# Altium schematic sheet Microcontroller.SchDoc
size A; Organization: Underwater Robotics; Address1: c/o Student Involvement; Address2: Campus Box 7306; Address3: 2016 Cates Ave. Raleigh, NC 27695; Revision: A1; SheetNumber: 2B; SheetTotal: 4B
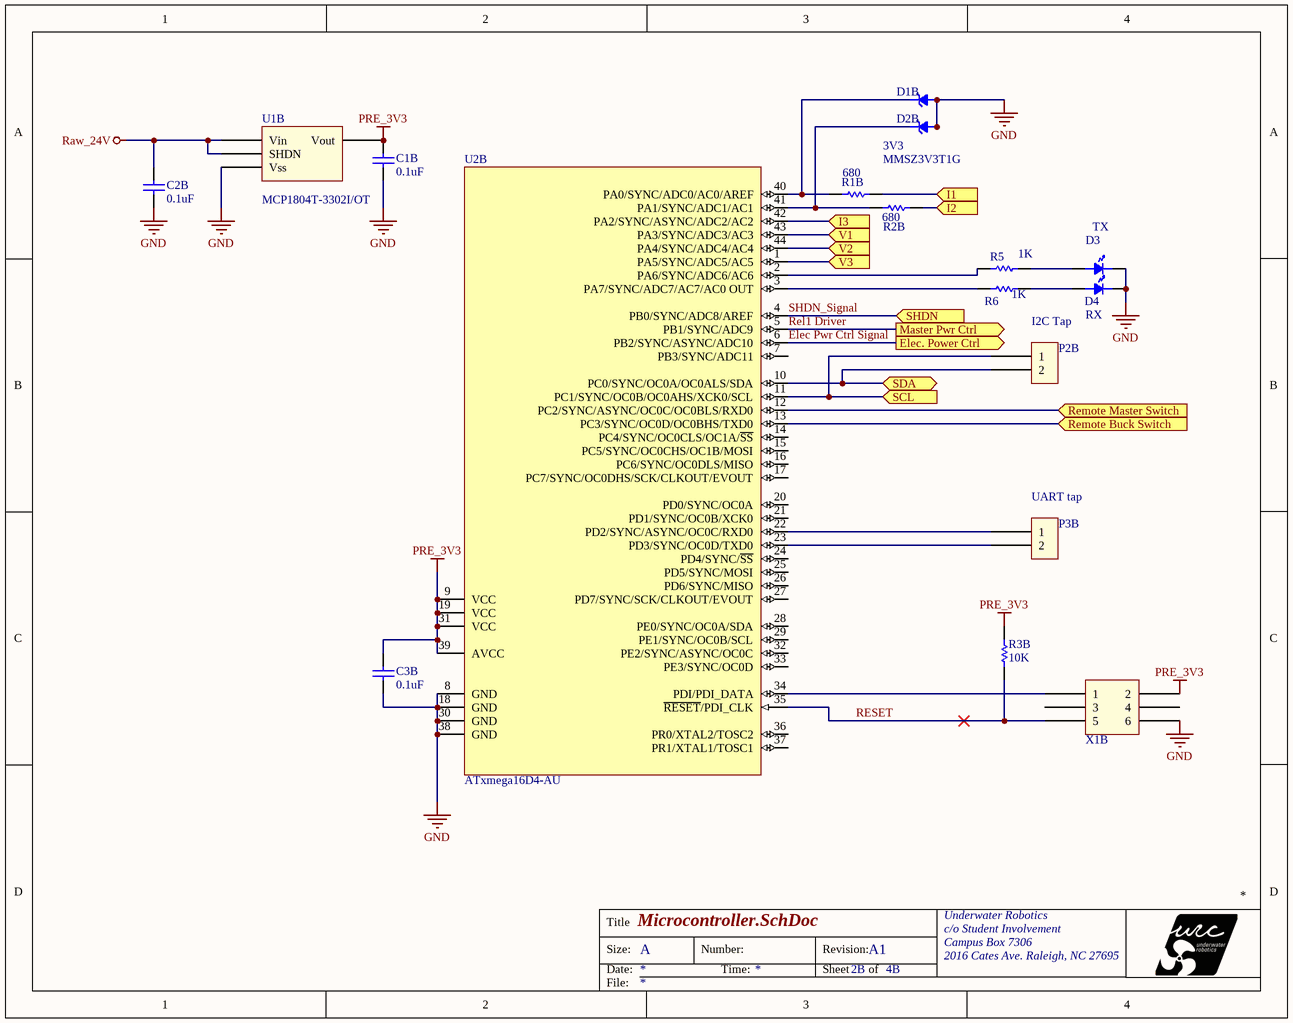
[diagram p0: Microcontroller.SchDoc]

## Parts
C1B  value 0.1uF  [C0805]  (hidden comment: 0.1uF, C0805, AVX)
C2B  value 0.1uF  [C0805]  (hidden comment: 0.1uF, C0805, AVX)
C3B  value 0.1uF  [C0805]  (hidden comment: 0.1uF, C0805, AVX)
D1B  value 3V3  Manufacturer Part Number: MMSZ3V3T1G  [ONSC-SOD123-2-498_A_V]  (hidden comment: MMSZ3V3T1G, 3V3 Zener Diode)
D2B  MMSZ3V3T1G, 3V3 Zener Diode  [ONSC-SOD123-2-498_A_V]  (value not drawn)
D3  LED  [LED0805]  (value not drawn)
D4  LED  [LED0805]  (value not drawn)
P2B  Header  [1x2 Header]  (value not drawn)
P3B  Header  [1x2 Header]  (value not drawn)
R1B  value 680  [R0603]  (hidden comment: Resistor)
R2B  value 680  [R0603]  (hidden comment: Resistor)
R3B  value 10K  [R0603]  (hidden comment: Resistor)
R5  value 1K  [R0603]  (hidden comment: Resistor)
R6  value 1K  [R0603]  (hidden comment: Resistor)
U1B  MCP1804T-3302I/OT  [MCP1804T-3302I/OT]
U2B  ATxmega16D4-AU  [44A_N]
X1B  Header  [2x3 Header]  (value not drawn)

## Ports
Elec. Power Ctrl (out), I1 (in), I2 (in), I3 (in), Master Pwr Ctrl (out), Remote Buck Switch (in), Remote Master Switch (in), SCL (in), SDA (bidir), SHDN (in), V1 (in), V2 (in), V3 (in)

## Nets
GND: C1B.2 C2B.2 C3B.2 D1B.A D2B.A D3.1 D4.1 U1B.Vss U2B.8(GND) U2B.18(GND) U2B.30(GND) U2B.38(GND) X1B.6
PRE_3V3: C1B.1(+) C3B.1(+) R3B.2 U1B.Vout U2B.9(VCC) U2B.19(VCC) U2B.31(VCC) U2B.39(AVCC) X1B.2
Raw_24V: C2B.1(+) U1B.SHDN U1B.Vin
Elec Pwr Ctrl Signal: U2B.6(PB2/SYNC/ASYNC/ADC10) ; port Elec. Power Ctrl
I1: R1B.2 ; port I1
I2: R2B.2 ; port I2
I3: U2B.42(PA2/SYNC/ASYNC/ADC2/AC2) ; port I3
Rel1 Driver: U2B.5(PB1/SYNC/ADC9) ; port Master Pwr Ctrl
Remote Buck Switch: U2B.13(PC3/SYNC/OC0D/OC0BHS/TXD0) ; port Remote Buck Switch
Remote Master Switch: U2B.12(PC2/SYNC/ASYNC/OC0C/OC0BLS/RXD0) ; port Remote Master Switch
RESET: R3B.1 U2B.35(~{RESET}/PDI_CLK) X1B.5
SCL: P2B.1 U2B.11(PC1/SYNC/OC0B/OC0AHS/XCK0/SCL) ; port SCL
SDA: P2B.2 U2B.10(PC0/SYNC/OC0A/OC0ALS/SDA) ; port SDA
SHDN_Signal: U2B.4(PB0/SYNC/ADC8/AREF) ; port SHDN
V1: U2B.43(PA3/SYNC/ADC3/AC3) ; port V1
V2: U2B.44(PA4/SYNC/ADC4/AC4) ; port V2
V3: U2B.1(PA5/SYNC/ADC5/AC5) ; port V3
NetD1B_K: D1B.K R1B.1 U2B.40(PA0/SYNC/ADC0/AC0/AREF)
NetD2B_K: D2B.K R2B.1 U2B.41(PA1/SYNC/ADC1/AC1)
NetD3_2: D3.2 R5.2
NetD4_2: D4.2 R6.2
NetP3B_1: P3B.1 U2B.22(PD2/SYNC/ASYNC/OC0C/RXD0)
NetP3B_2: P3B.2 U2B.23(PD3/SYNC/OC0D/TXD0)
NetR5_1: R5.1 U2B.2(PA6/SYNC/ADC6/AC6)
NetR6_1: R6.1 U2B.3(PA7/SYNC/ADC7/AC7/AC0_OUT)
NetU2B_34: U2B.34(PDI/PDI_DATA) X1B.1

Not connected (* = marked no-connect by the designer): U2B 7(PB3/SYNC/ADC11) 14(PC4/SYNC/OC0CLS/OC1A/~{SS}) 15(PC5/SYNC/OC0CHS/OC1B/MOSI) 16(PC6/SYNC/OC0DLS/MISO) 17(PC7/SYNC/OC0DHS/SCK/CLKOUT/EVOUT) 20(PD0/SYNC/OC0A) 21(PD1/SYNC/OC0B/XCK0) 24(PD4/SYNC/~{SS}) 25(PD5/SYNC/MOSI) 26(PD6/SYNC/MISO) 27(PD7/SYNC/SCK/CLKOUT/EVOUT) 28(PE0/SYNC/OC0A/SDA) 29(PE1/SYNC/OC0B/SCL) 32(PE2/SYNC/ASYNC/OC0C) 33(PE3/SYNC/OC0D) 36(PR0/XTAL2/TOSC2) 37(PR1/XTAL1/TOSC1); X1B 3 4

## Notes on the sheet
- TX
- I2C Tap
- (near D4) RX
- (near P3B) UART tap
- Title
- Size:
- Date:
- A
- Number:
- Time:
- Revision:
- Sheet
- of
- File:

## Library data of the parts
C1B C2B C3B = 0.1uF, C0805, AVX: Ceramic MLCC, AVX, X5R Dielectric; Manufacturer Part Number: 08055C104JAT2A; Description 1: AVX - 08055C104JAT2A - MLCC CAPACITOR, 0.1uF, 50V, X7R, 5%, 0805; Capacitance: 0.1 F; Capacitance Tolerance: 5%; Dielectric Characteristic: X7; Voltage Rating: 50; Ceramic Capacitor Case: 0805 [2012 Metric]; Supplier 1: Newark; Supplier Part Number 1: 96K4778; Manufacturer 1: AVX; RoHS: YES; Stock 1: 26154; Pricing 1: 1=0.009, 10=0.009, 100=0.009, 250=0.009, 500=0.009, 1000=0.009 (USD); Product Range: -; Operating Temperature Min: -55 C; ComponentLink1URL: http://www.farnell.com/datasheets/1818074.pdf; ComponentLink1Description: http://www.farnell.com/datasheets/1818074.pdf
D1B D2B = MMSZ3V3T1G, 3V3 Zener Diode: 3V3 Zener Diode; Manufacturer 1: ON SEMICONDUCTOR; Description 1: ON SEMICONDUCTOR - MMSZ3V3T1G - ZENER DIODE, 500mW, 3.3V, SOD-123; Supplier 1: Newark; Supplier Part Number 1: 71J6023; RoHS: YES; Stock 1: 30308; Pricing 1: 1=0.24, 50=0.156, 100=0.065, 250=0.063, 500=0.061, 1000=0.044, 3000=0.035, 9000=0.029 (USD); ComponentLink1URL: http://www.farnell.com/datasheets/78656.pdf; ComponentLink1Description: http://www.farnell.com/datasheets/78656.pdf
  D2B: Manufacturer Part Number: MMSZ3V3T1G; Value: 3V3
P2B P3B = 1x2 Header
R1B R2B = 680, 5%, 100mW, Yageo, R0603: Manufacturer 1: YAGEO; Manufacturer Part Number: RC0603JR-07680RL; Tolerance: 5%; Description 1: YAGEO - RC0603JR-07680RL - RES, THICK FILM, 680R, 5%, 0.1W, 0603; Product Range: RC Series; Power Rating: 100; Voltage Rating: 50; Resistor Case Style: 0603 [1608 Metric]; Body Width: 0.8; Supplier 1: Newark; Supplier Part Number 1: 68R0206; RoHS: YESX; Stock 1: 8787; Pricing 1: 1=0.07, 10=0.012, 25=0.008, 100=0.005, 250=0.004, 1000=0.002 (USD); Resistance: 680; Resistance Tolerance: 5%; Packaging: Cut Tape; MSL: -; ComponentLink1URL: http://past.yageo.com/pdf/PYu-R_Packing_6.pdf; ComponentLink1Description: http://past.yageo.com/pdf/PYu-R_Packing_6.pdf; ComponentLink2URL: http://www.farnell.com/cad/1538988.zip; ComponentLink2Description: http://www.farnell.com/cad/1538988.zip; ComponentLink3URL: http://www.farnell.com/datasheets/1868787.pdf; ComponentLink3Description: http://www.farnell.com/datasheets/1868787.pdf; ComponentLink4URL: http://www.yageo.com/pdf/PYu-RC0603_51_RoHS_L_4.pdf; ComponentLink4Description: http://www.yageo.com/pdf/PYu-RC0603_51_RoHS_L_4.pdf
R3B = 10k, 1%, 100mW, Yageo, R0603: Manufacturer 1: YAGEO; Manufacturer Part Number: RC0603FR-1010KL; Tolerance: 1%; Description 1: YAGEO - RC0603FR-1010KL - RES, THICK FILM, 10K, 1%, 0.1W, 0603; Product Range: RC Series; Resistance: 10; Power Rating: 100; Voltage Rating: 50; Resistor Case Style: 0603 [1608 Metric]; Body Length: 1.6; Supplier 1: Newark; Supplier Part Number 1: 68R0120; RoHS: YESX; Stock 1: 7839; Pricing 1: 1=0.002, 10=0.002, 25=0.002, 100=0.002, 250=0.002, 1000=0.002 (USD); Resistance Tolerance: 1%; Packaging: Cut Tape; MSL: -; ComponentLink1URL: http://www.farnell.com/datasheets/1868787.pdf; ComponentLink1Description: http://www.farnell.com/datasheets/1868787.pdf; ComponentLink2URL: http://www.yageo.com/pdf/PYu-RC0603_51_RoHS_L_4.pdf; ComponentLink2Description: http://www.yageo.com/pdf/PYu-RC0603_51_RoHS_L_4.pdf
R5 R6 = 1k, 5%, 100mW, Yageo, R0603: Manufacturer 1: YAGEO; Manufacturer Part Number: RC0603JR-131KL; Tolerance: 5%; Description 1: YAGEO - RC0603JR-131KL - RES, THICK FILM, 1K, 5%, 0.1W, 0603; Product Range: RC Series; Resistance: 1; Power Rating: 100; Voltage Rating: 50; Resistor Case Style: 0603 [1608 Metric]; Body Height: 0.45; Supplier 1: Newark; Supplier Part Number 1: 68R0220; RoHS: YESX; Stock 1: 36430; Pricing 1: 1=0.06, 10=0.011, 25=0.008, 100=0.005, 250=0.003, 1000=0.002 (USD); Resistance Tolerance: 5%; Packaging: Cut Tape; MSL: -; ComponentLink1URL: http://www.farnell.com/datasheets/1868787.pdf; ComponentLink1Description: http://www.farnell.com/datasheets/1868787.pdf; ComponentLink2URL: http://www.yageo.com/pdf/PYu-RC0603_51_RoHS_L_4.pdf; ComponentLink2Description: http://www.yageo.com/pdf/PYu-RC0603_51_RoHS_L_4.pdf
U1B = MCP1804T-3302I/OT: 3.3V Linear Regulator; Manufacturer 1: MICROCHIP; Description 1: MICROCHIP - MCP1804T-3302I/OT - LDO VOLTAGE REGULATOR, 3.3V, 150mA, 5-SOT-23; Input Voltage Min: 2; Input Voltage Max: 28; Output Current: 150; Dropout Voltage Vdo: 260; LDO Regulator Case Style: SOT-23; No. of Pins: 5; URL: http://www.newark.com/microchip/mcp1804t-3302i-ot/ldo-voltage-regulator-3-3v-150ma/dp/55R1047; Supplier 1: Newark; Supplier Part Number 1: 55R1047; RoHS: YES; Stock 1: 12; Pricing 1: 1=0.67, 26=0.56, 100=0.51 (USD); Operating Temperature Min: -40 C; ComponentLink1URL: http://www.farnell.com/datasheets/1789199.pdf; ComponentLink1Description: http://www.farnell.com/datasheets/1789199.pdf; ComponentLink2URL: http://www.farnell.com/cad/1790647.zip; ComponentLink2Description: http://www.farnell.com/cad/1790647.zip; Manufacturer Part Number: MCP1804T-3302I/OT
U2B = ATxmega16D4-AU: 8/16-bit AVR XMEGA D4 Microcontroller, 1.6-3.6V, 32MHz, 16KB + 4KB Flash, 1KB EEPROM, 2KB SRAM, 44-pin TQFP, Industrial Grade (-40°C to 85°C), Pb-Free; Manufacturer 1: ATMEL; Description 1: ATMEL - ATXMEGA16D4-AU - MICROCONTROLLER MCU, 8 BIT, AVR XMEGA, 32MHZ, TQFP-44; CPU Speed: 32; Program Memory Size: 16; RAM Memory Size: 2; No. of Pins: 44; No. of I/O's: 34; Supply Voltage Min: 1.6; DatasheetVersion: revJ, Dec-2010; PackageVersion: revC, Oct-2010; PackageReference: 44A; PackageDescription: 44-Pin Plastic Thin Profile Quad Flat Pack, 10 x 10 x 1.0 mm Body, 0.8 mm Pitch (TQFP); Code_JEDEC: MS-026-ACB; ComponentLink1Description: Manufacturer URL; ComponentLink1URL: http://www.atmel.com/; ComponentLink2Description: ATxmega128D4/64D4/32D4/16D4 Datasheet; ComponentLink2URL: http://www.atmel.com/dyn/resources/prod_documents/doc8135.pdf; Supplier 1: Newark; Supplier Part Number 1: 68T3906; Manufacturer Part Number: ATXMEGA16D4-AU; RoHS: YES; Stock 1: 196; Pricing 1: 1=2.71, 10=2.38, 25=2.24, 50=1.9, 100=1.79, 250=1.72, 500=1.69, 1000=1.49 (USD); Controller Family/Series: ATxmega; MCU Case Style: TQFP; ComponentLink3URL: http://www.farnell.com/datasheets/1693882.pdf; ComponentLink3Description: http://www.farnell.com/datasheets/1693882.pdf; ComponentLink4URL: http://www.farnell.com/cad/1773743.zip; ComponentLink4Description: http://www.farnell.com/cad/1773743.zip; ComponentLink5URL: http://bcove.me/gu8hm7kh; ComponentLink5Description: http://bcove.me/gu8hm7kh
X1B = 2x3 Header: Manufacturer 1: FCI; Manufacturer Part Number: 67996-406HLF; Description 1: FCI - 67996-406HLF - BOARD-BOARD CONNECTOR HEADER, 6 POSITION, 2ROW; Product Range: BergStik 67996 Series; Contact Termination Type: Through Hole; No. of Contacts: 6; Pitch Spacing: 2.54; No. of Rows: 2; Supplier Part Number 1: 20M2191; Supplier 1: Newark; RoHS: YES; Stock 1: 441; Pricing 1: 1=0.254, 10=0.218, 25=0.186, 50=0.178, 100=0.16, 250=0.153, 500=0.128, 1000=0.117 (USD); Gender: Header; Contact Plating: Tin Plated Contacts; ComponentLink1URL: http://www.farnell.com/datasheets/1876884.pdf; ComponentLink1Description: http://www.farnell.com/datasheets/1876884.pdf